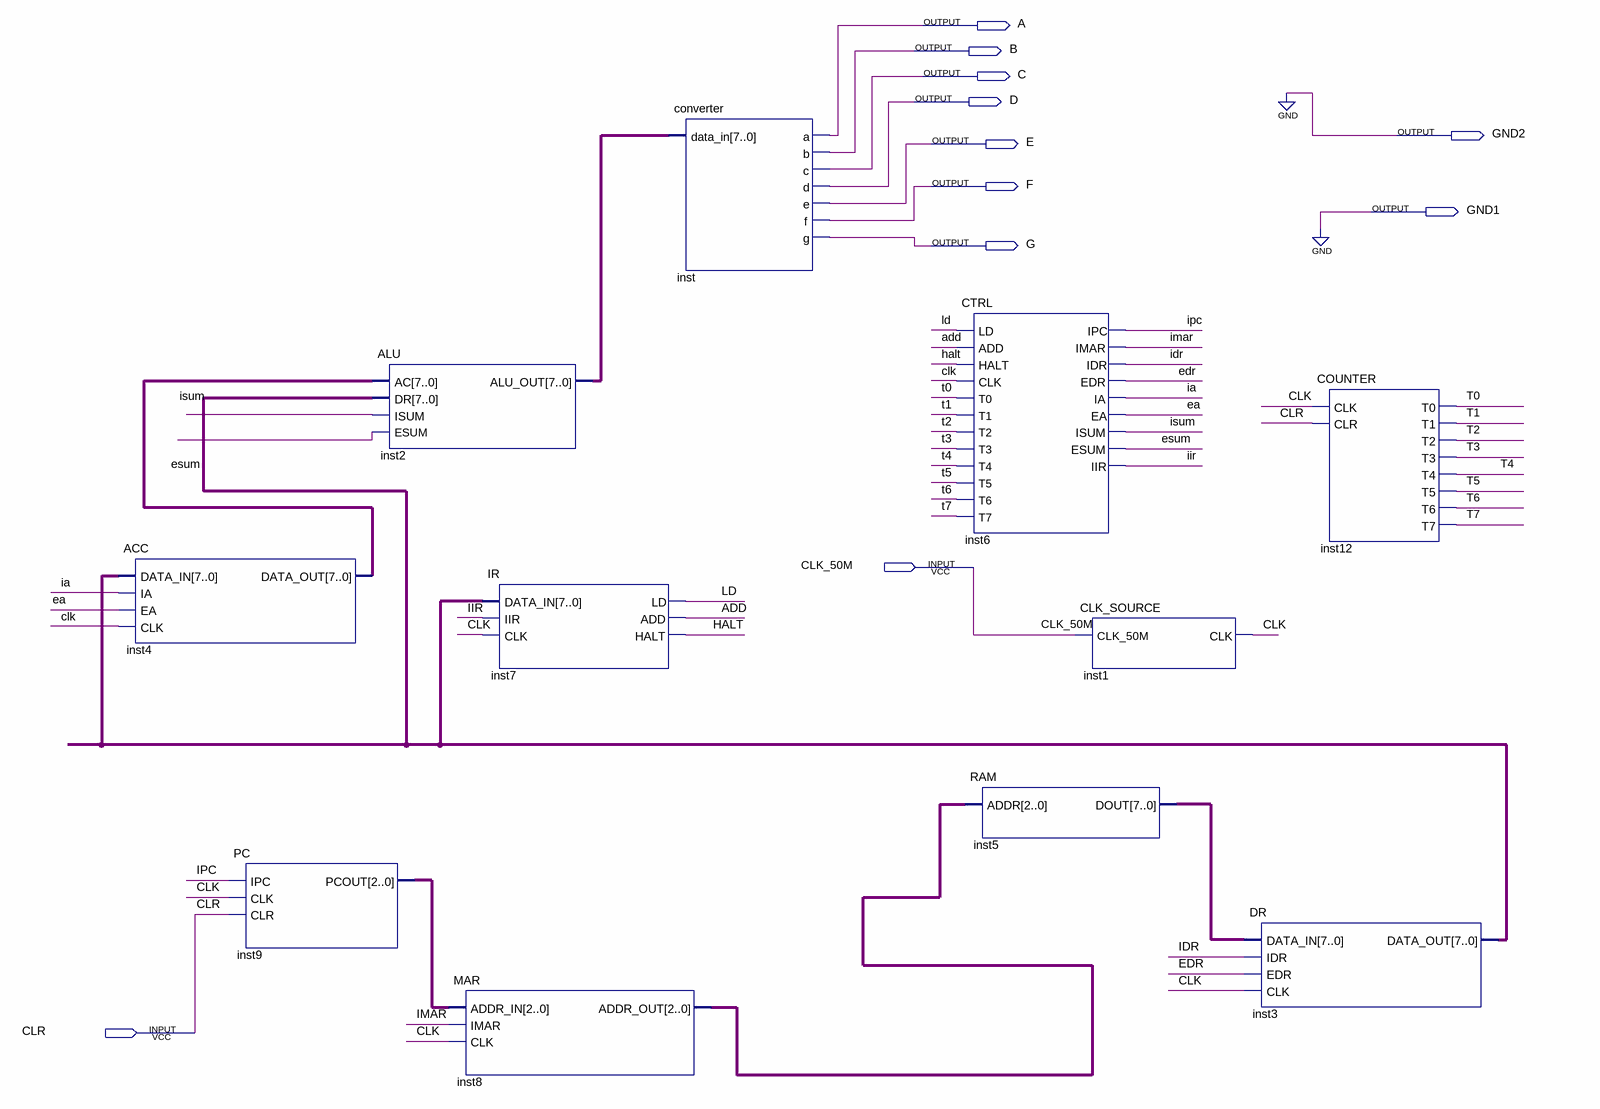
[diagram p0: schematic sheet]
// Quartus schematic MC_TEMP.bdf as structural Verilog: 11 symbols, 11 pins
module MC_TEMP (
  input  CLK_50M,
  input  CLR,
  output A,
  output B,
  output C,
  output D,
  output GND2,
  output E,
  output F,
  output GND1,
  output G
);

  wire ADD, clk, ea, EDR, esum, HALT, ia, IDR, IIR, IMAR, IPC, isum, LD, T0, T1, T2, T3, T4, T5, T6, T7;
  wire [2:0] inst8_addr_out, inst9_pcout;
  wire [7:0] inst2_alu_out, inst3_data_out, inst4_data_out, inst5_dout;

  ACC inst4 (.DATA_IN(inst3_data_out), .IA(ia), .EA(ea), .CLK(clk), .DATA_OUT(inst4_data_out));
  PC inst9 (.IPC(IPC), .CLK(clk), .CLR(CLR), .PCOUT(inst9_pcout));
  ALU inst2 (.AC(inst4_data_out), .DR(inst3_data_out), .ISUM(isum), .ESUM(esum), .ALU_OUT(inst2_alu_out));
  IR inst7 (.DATA_IN(inst3_data_out), .IIR(IIR), .CLK(clk), .LD(LD), .ADD(ADD), .HALT(HALT));
  MAR inst8 (.ADDR_IN(inst9_pcout), .IMAR(IMAR), .CLK(clk), .ADDR_OUT(inst8_addr_out));
  converter inst (.data_in(inst2_alu_out), .a(A), .b(B), .c(C), .d(D), .e(E), .f(F), .g(G));
  CTRL inst6 (
    .LD(LD), .ADD(ADD), .HALT(HALT), .CLK(clk), .T0(T0), .T1(T1), .T2(T2), .T3(T3), .T4(T4), .T5(T5),
    .T6(T6), .T7(T7), .IPC(IPC), .IMAR(IMAR), .IDR(IDR), .EDR(EDR), .IA(ia), .EA(ea), .ISUM(isum),
    .ESUM(esum), .IIR(IIR));
  RAM inst5 (.ADDR(inst8_addr_out), .DOUT(inst5_dout));
  CLK_SOURCE inst1 (.CLK_50M(CLK_50M), .CLK(clk));
  DR inst3 (.DATA_IN(inst5_dout), .IDR(IDR), .EDR(EDR), .CLK(clk), .DATA_OUT(inst3_data_out));
  COUNTER inst12 (.CLK(clk), .CLR(CLR), .T0(T0), .T1(T1), .T2(T2), .T3(T3), .T4(T4), .T5(T5), .T6(T6), .T7(T7));

  assign GND1 = 1'b0;
  assign GND2 = 1'b0;
endmodule
